# Altium schematic sheet rs485m.SchDoc
size A4
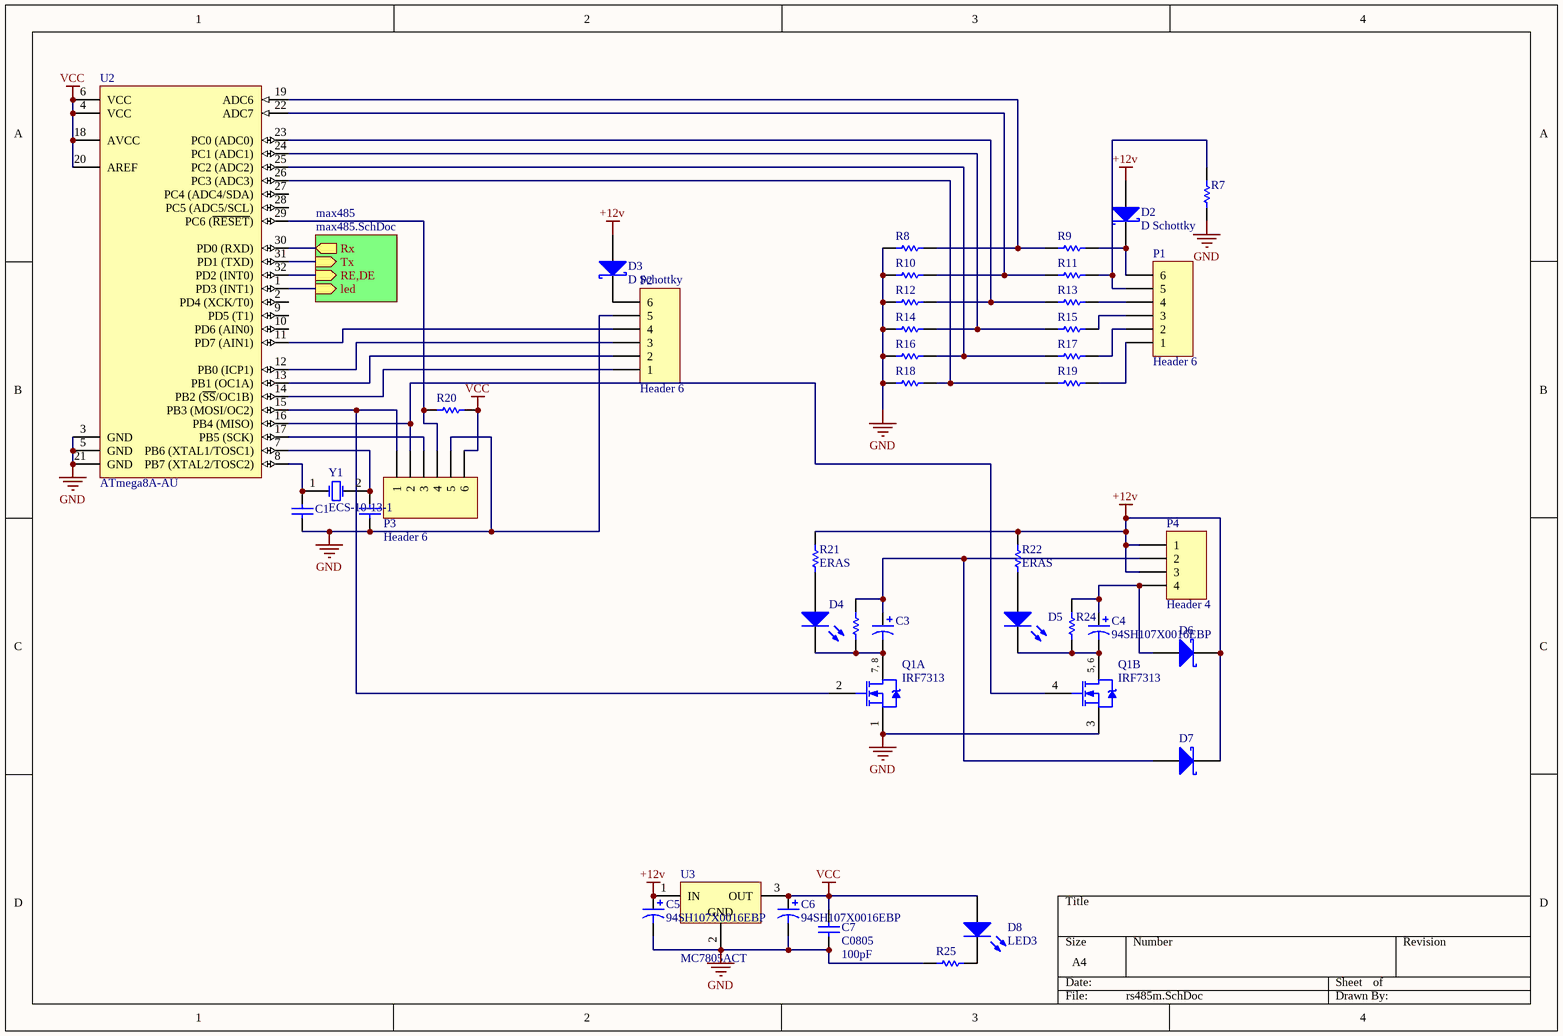
[diagram p0: rs485m.SchDoc]

## Parts
C1  C0805  [0805]  (value not drawn)
C2  C0805  [0805]  (value not drawn)
C3  94SH107X0016EBP  [E]  (value not drawn)
C4  94SH107X0016EBP  [E]
C5  94SH107X0016EBP  [E]
C6  94SH107X0016EBP  [E]
C7  C0805  value 100pF  [0805]
D2  D Schottky  [SMB]
D3  D Schottky  [SMB]
D4  LED3  [3.5X2.8X1.9]  (value not drawn)
D5  LED3  [3.5X2.8X1.9]  (value not drawn)
D6  D Schottky  [SMB]  (value not drawn)
D7  D Schottky  [SMB]  (value not drawn)
D8  LED3  [3.5X2.8X1.9]
P1  Header 6  [HDR1X6]
P2  Header 6  [HDR1X6]
P3  Header 6  [HDR1X6]
P4  Header 4  [HDR1X4]
Q1  IRF7313  [SO-8_N]  (parts A,B of 2)
R7  ERAS  [ERA-0805]  (value not drawn)
R8  ERAS  [ERA-0805]  (value not drawn)
R9  ERAS  [ERA-0805]  (value not drawn)
R10  ERAS  [ERA-0805]  (value not drawn)
R11  ERAS  [ERA-0805]  (value not drawn)
R12  ERAS  [ERA-0805]  (value not drawn)
R13  ERAS  [ERA-0805]  (value not drawn)
R14  ERAS  [ERA-0805]  (value not drawn)
R15  ERAS  [ERA-0805]  (value not drawn)
R16  ERAS  [ERA-0805]  (value not drawn)
R17  ERAS  [ERA-0805]  (value not drawn)
R18  ERAS  [ERA-0805]  (value not drawn)
R19  ERAS  [ERA-0805]  (value not drawn)
R20  ERAS  [ERA-0805]  (value not drawn)
R21  ERAS  [ERA-0805]
R22  ERAS  [ERA-0805]
R23  ERAS  [ERA-0805]  (value not drawn)
R24  ERAS  [ERA-0805]  (value not drawn)
R25  ERAS  [ERA-0805]  (value not drawn)
U2  ATmega8A-AU  [32A_N]
U3  MC7805ACT  [221A-06]
Y1  ECS-10-13-1  [HC-49U]

## Sub-sheets
max485 = max485.SchDoc: Rx (out), Tx (in), RE,DE (in), led (in)

## Nets
+12v: C5.1 D2.1(A) D3.1(A) D6.2(K) D7.2(K) P4.1 P4.3 R21.1 R22.1 U3.1(IN)
GND: C1.2 C2.2 C5.2 C6.2 C7.1 P2.5 P3.5 Q1.1(S) Q1.3(S) R7.2 R8.2 R10.2 R12.2 R14.2 R16.2 R18.2 R25.2 U2.3(GND) U2.5(GND) U2.21(GND) U3.2(GND)
VCC: C6.1 C7.2 D8.1(A) P3.6 R20.1 U2.4(VCC) U2.6(VCC) U2.18(AVCC) U2.20(AREF) U3.3(OUT)
NetC1_1: C1.1 U2.8(PB7_(XTAL2/TOSC2)) Y1.1(OSC1)
NetC2_1: C2.1 U2.7(PB6_(XTAL1/TOSC1)) Y1.2(OSC2)
NetC3_1: C3.1 D7.1(A) P4.2 R23.1
NetC3_2: C3.2 D4.2(K) Q1.7(D) Q1.8(D) R23.2
NetC4_1: C4.1 D6.1(A) P4.4 R24.1
NetC4_2: C4.2 D5.2(K) Q1.5(D) Q1.6(D) R24.2
NetD2_2: D2.2(K) P1.6 R9.1
NetD3_2: D3.2(K) P2.6
NetD4_1: D4.1(A) R21.2
NetD5_1: D5.1(A) R22.2
NetD8_2: D8.2(K) R25.1
NetP1_1: P1.1 R19.1
NetP1_2: P1.2 R17.1
NetP1_3: P1.3 R15.1
NetP1_4: P1.4 R13.1
NetP1_5: P1.5 R7.1 R11.1
NetP2_1: P2.1 U2.14(PB2_(~{SS}/OC1B))
NetP2_2: P2.2 U2.13(PB1_(OC1A))
NetP2_3: P2.3 U2.12(PB0_(ICP1))
NetP2_4: P2.4 U2.11(PD7_(AIN1))
NetP3_1: P3.1 Q1.2(G) U2.15(PB3_(MOSI/OC2))
NetP3_2: P3.2 Q1.4(G) U2.16(PB4_(MISO))
NetP3_3: P3.3 U2.17(PB5_(SCK))
NetP3_4: P3.4 R20.2 U2.29(PC6_(~{RESET}))
NetR8_1: R8.1 R9.2 U2.19(ADC6)
NetR10_1: R10.1 R11.2 U2.22(ADC7)
NetR12_1: R12.1 R13.2 U2.23(PC0_(ADC0))
NetR14_1: R14.1 R15.2 U2.24(PC1_(ADC1))
NetR16_1: R16.1 R17.2 U2.25(PC2_(ADC2))
NetR18_1: R18.1 R19.2 U2.26(PC3_(ADC3))
NetU2_1: U2.1(PD3_(INT1)) ; sheet max485/led
NetU2_30: U2.30(PD0_(RXD)) ; sheet max485/Rx
NetU2_31: U2.31(PD1_(TXD)) ; sheet max485/Tx
NetU2_32: U2.32(PD2_(INT0)) ; sheet max485/RE,DE

Not connected (* = marked no-connect by the designer): U2 2(PD4_(XCK/T0)) 9(PD5_(T1)) 10(PD6_(AIN0)) 27(PC4_(ADC4/SDA)) 28(PC5_(ADC5/SCL))

## Notes on the sheet
- (in symbol IRF7313, part A) 7, 8
- (in symbol IRF7313, part B) 5, 6

## Library data of the parts
C1 C2 = C0805: Ceramic Chip Capacitor - Standard; Note: Footprint corresponds to dimensions for bulk cassette packaging. This case size has tightened tolerances.; Value: 100pF; Published: 17-Jul-2002; LatestRevisionDate: 19-Mar-2004; LatestRevisionNote: Silkscreen size reduced.; DatasheetDocument: Mar-2001; PackageDocument: Mar-2001; PackageReference: 0805; Publisher: Altium Limited; Code_JEITA: 0805; Code_IPC: 2012[0805]; ComponentLink1Description: Manufacturer Link; ComponentLink1URL: http://www.kemet.com/; ComponentLink2Description: Datasheet; ComponentLink2URL: http://www.kemet.com/kemet/web/homepage/kechome.nsf/vapubfilesname/F3102TA.pdf/$file/F3102TA.pdf
C3-C6 = 94SH107X0016EBP: Solid Aluminum Capacitor with Organic Semiconductor Electrolyte: 100uF, 16V, Bulk Pack; Note: Part Numbers shown are for ± 20% capacitance tolerance (X0).; PCB_Layout: Complies with Manufacturer's Recommendation.; DrillSize: Nominal, Rounded to the nearest 0.1mm; Published: 19-Mar-2004; DatasheetDocument: 23-May-2001; PackageReference: E; Publisher: Altium Limited; ComponentLink1Description: Manufacturer Link; ComponentLink1URL: http://www.vishay.com/; ComponentLink2Description: Datasheet; ComponentLink2URL: http://www.vishay.com/docs/90006/94sh.pdf; Value: 100uF
C7 = C0805: Ceramic Chip Capacitor - Standard; Note: Footprint corresponds to dimensions for bulk cassette packaging. This case size has tightened tolerances.; Published: 17-Jul-2002; LatestRevisionDate: 19-Mar-2004; LatestRevisionNote: Silkscreen size reduced.; DatasheetDocument: Mar-2001; PackageDocument: Mar-2001; PackageReference: 0805; Publisher: Altium Limited; Code_JEITA: 0805; Code_IPC: 2012[0805]; ComponentLink1Description: Manufacturer Link; ComponentLink1URL: http://www.kemet.com/; ComponentLink2Description: Datasheet; ComponentLink2URL: http://www.kemet.com/kemet/web/homepage/kechome.nsf/vapubfilesname/F3102TA.pdf/$file/F3102TA.pdf
D2 D3 D6 D7 = D Schottky: Schottky Diode; Published: 8-Jun-2000; LatestRevisionDate: 17-Jul-2002; LatestRevisionNote: Re-released for DXP Platform.; PackageReference: SMB; Publisher: Altium Limited; PackageDescription: DO-214-AA/SMB; 2 C-Bend Leads; Body 5.3 x 3.6 mm, inc. leads (LxW); Code_JEDEC: DO-214-AA
D4 D5 D8 = LED3: Typical BLUE SiC LED; Published: 8-Jun-2000; LatestRevisionDate: 17-Dec-2003; LatestRevisionNote: PCB Footprint replaced.; DatasheetVersion: 16-Apr-2002; PackageVersion: 16-Apr-2002; PackageReference: 3.5X2.8X1.9; Publisher: Altium Limited; PackageDescription: SM LED; 2 C-Bend Leads; Body 3.5 x 2.8 x 1.9 mm, inc leads (LxWxH typ)
P1-P3 = Header 6: Header, 6-Pin; LatestRevisionDate: 17-Jul-2002; LatestRevisionNote: Re-released for DXP Platform.; Publisher: Altium Limited
P4 = Header 4: Header, 4-Pin; LatestRevisionDate: 17-Jul-2002; LatestRevisionNote: Re-released for DXP Platform.; Publisher: Altium Limited
Q1 = IRF7313: HEXFET Power MOSFET; Published: 8-Jun-2000; LatestRevisionDate: 13-Apr-2006; LatestRevisionNote: IPC-7351 Footprint Added.; DatasheetVersion: Aug-1997; PackageVersion: Feb-2001; PackageReference: SO-8; Publisher: Altium Limited; PackageDescription: 8-Pin Plastic Small Outline Integrated Circuit 1.27 mm Pitch; Code_JEDEC: MS-012-AA; Code_IPC: SOIC127P600-8; ComponentLink1Description: Manufacturer Link; ComponentLink1URL: http://www.irf.com/; ComponentLink2Description: Datasheet; ComponentLink2URL: http://www.irf.com/product-info/datasheets/data/irf7313.pdf
R7-R25 = ERAS: Metal Film Thermosensitive Chip Resistor, 0.56 Ohm to 10k Ohm Range, 5% Tolerance, 0805 Size, 0.1 W; Note: If flow soldering, adjust pad width of PCB Footprint to 0.7 - 0.8 times the width of the resistor.; Published: 17-Dec-2003; LatestRevisionDate: 19-Mar-2004; LatestRevisionNote: Silkscreen size reduced.; PackageDocument: Mar-2003; PackageReference: ERA-0805; Publisher: Altium Limited; Code_IPC: 2012 [0805]; ComponentLink1Description: Manufacturer Link; ComponentLink1URL: http://www.panasonic.com/industrial/components/resistive_products.htm; ComponentLink2Description: Datasheet; ComponentLink2URL: http://www.panasonic.com/industrial/components/pdf/AOF0000CE1.pdf
U2 = ATmega8A-AU: 8-bit AVR Microcontroller, 8KB Flash, 512 Bytes EEPROM, 1KB SRAM, 32-pin TQFP, Industrial Grade (-40°C to 85°C); Published: 1-Apr-2010; DatasheetVersion: revC, Jul-2009; PackageVersion: revB, Oct-2001; PackageReference: 32A; Publisher: Altium Limited; PackageDescription: 32-Lead, 7x7x1.0 mm Body, 0.8mm Lead Pitch, Thin Profile Plastic Quad Flat Package (TQFP); Supplier 1: Digi-Key; Supplier Part Number 1: ATMEGA8A-AU-ND; Supplier 2: Farnell; Supplier Part Number 2: 1748532; Supplier 3: Mouser; Supplier Part Number 3: 556-ATMEGA8A-AU; Code_JEDEC: MS-026-ABA; ComponentLink1Description: Manufacturer Link; ComponentLink1URL: http://www.atmel.com/products/avr/default.asp?; ComponentLink2Description: ATmega8A Datasheet; ComponentLink2URL: http://www.atmel.com/dyn/resources/prod_documents/doc8159.pdf; ComponentLink3Description: ATmega8A Summary; ComponentLink3URL: http://www.atmel.com/dyn/resources/prod_documents/8159S.pdf; ComponentLink4Description: Atmel.com Home; ComponentLink4URL: http://www.atmel.com
U3 = MC7805ACT: Three-Terminal Positive Voltage Regulator; Note: Heatsink surface is connected to Pin 2; Published: 15-Apr-2002; DatasheetVersion: 1997; PackageVersion: 1997; PackageReference: 221A-06; Publisher: Altium Limited; PackageDescription: TO, Thru-Hole, Vertical, Heatsink Mounted; 3 In-Line Leads; Pitch 2.54 mm; Code_JEDEC: TO-262-AA; ComponentLink1Description: Manufacturer Link; ComponentLink1URL: http://www.onsemi.com/site/products/taxonomy/0,4438,503,00.html; ComponentLink2Description: Datasheet; ComponentLink2URL: http://www.onsemi.com/pub/Collateral/MC7800-D.PDF
Y1 = ECS-10-13-1: Crystal Oscillator; Published: 17-Jul-2002; DatasheetDocument: 18-Apr-2000; PackageReference: HC-49U; Publisher: Altium Limited; ComponentLink1Description: Manufacturer Link; ComponentLink1URL: http://www.ecsxtal.com/; ComponentLink2Description: Datasheet; ComponentLink2URL: http://www.ecsxtal.com/pdf2/HC49U.PDF